# EasyEDA Pro project projeto.eprj

# Schematic Schematic1
Board Name: Board1; Create Date: 2025-10-07; Page Name: P1; Project Name: projeto; Schematic Name: Schematic1; Update Date: 2025-10-07; Company: EasyEDA.com; Page Size: A4; Version: V1.0
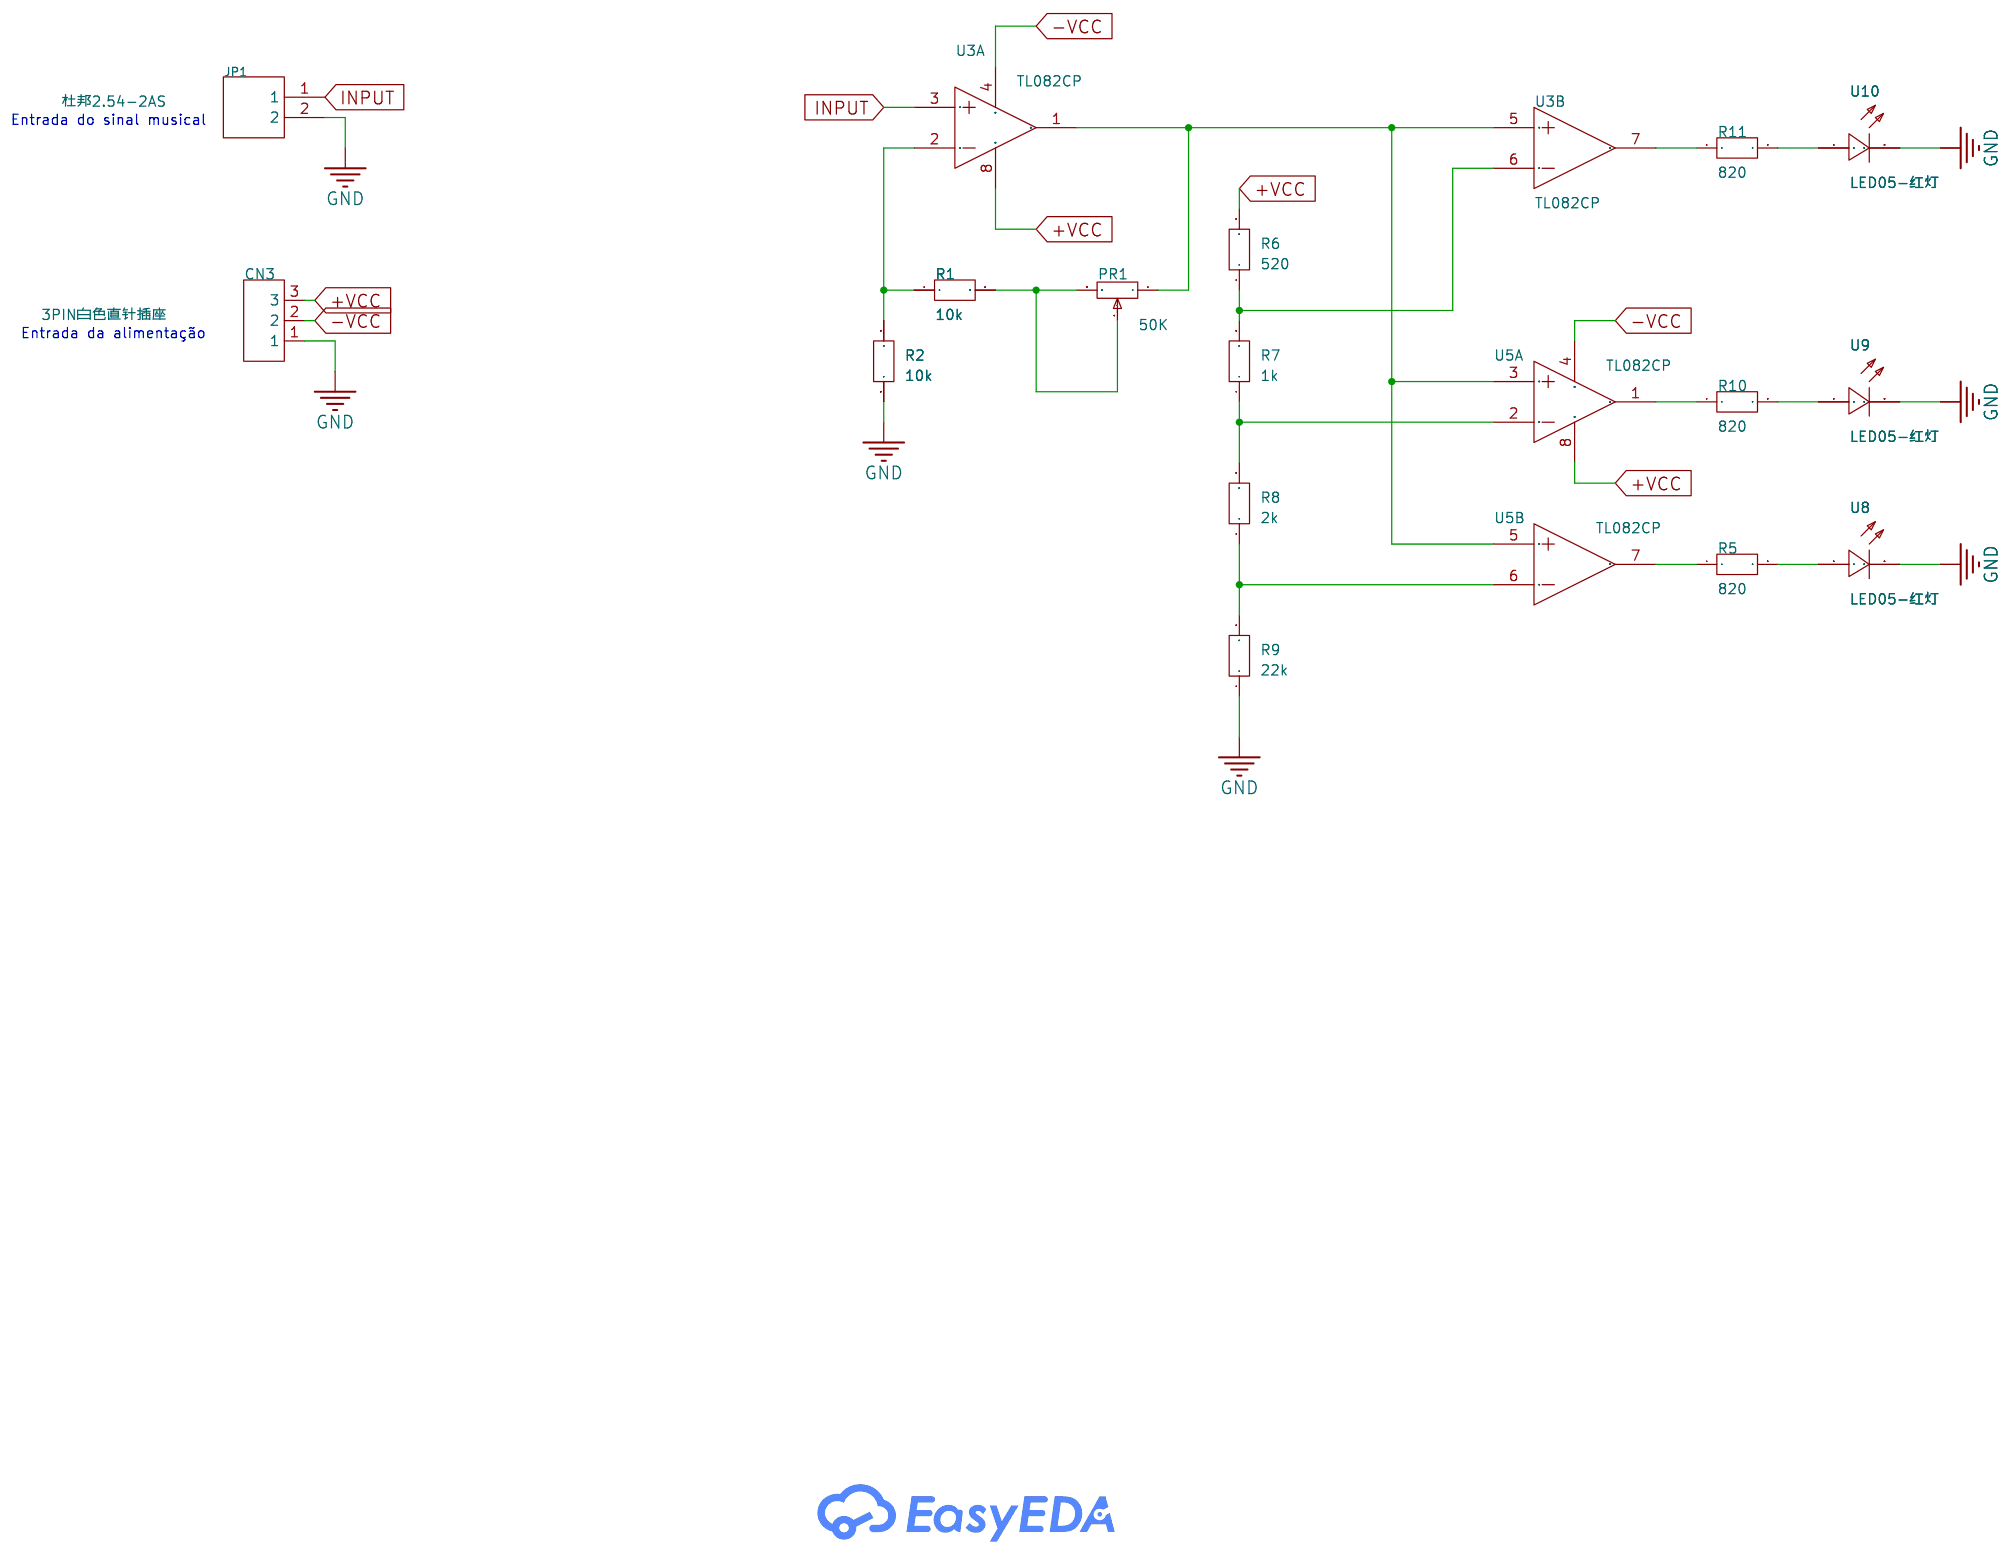
[diagram p0: schematic sheet]

## Parts
CN3  3PIN白色直针插座  [CONN-TH_3P-P2.50_3PIN]
JP1  杜邦2.54-2AS  [CONN-TH_2P-L7.6-W6.0-P2.54-V]
PR1  50K  [CONN-TH_3P-P2.50_3PIN]
R1  10k  [RES-TH_BD4.5-L11.5-P15.50-D0.7]
R2  10k  [RES-TH_BD4.5-L11.5-P15.50-D0.7]
R5  820  [RES-TH_BD4.5-L11.5-P15.50-D0.7]
R6  520  [RES-TH_BD4.5-L11.5-P15.50-D0.7]
R7  1k  [RES-TH_BD4.5-L11.5-P15.50-D0.7]
R8  2k  [RES-TH_BD4.5-L11.5-P15.50-D0.7]
R9  22k  [RES-TH_BD4.5-L11.5-P15.50-D0.7]
R10  820  [RES-TH_BD4.5-L11.5-P15.50-D0.7]
R11  820  [RES-TH_BD4.5-L11.5-P15.50-D0.7]
U3  TL082CP  [PDIP-8_L9.6-W6.4-P2.54-LS7.6-BL]  (sections 1,2)
U5  TL082CP  [PDIP-8_L9.6-W6.4-P2.54-LS7.6-BL]  (sections 1,2)
U8  LED05-红灯  [LED-TH_LED-3MM_RED]
U9  LED05-红灯  [LED-TH_LED-3MM_RED]
U10  LED05-红灯  [LED-TH_LED-3MM_RED]

## Library data of the parts
CN3 = 3PIN白色直针插座: Supplier Part: C9900004958; Supplier Footprint: XH2.54MM; JLCPCB Part Class: Extended Part; Supplier: LCSC
JP1 = 杜邦2.54-2AS: LCSC Part Name: 1x2P 间距:2.54mm 直插; Supplier Part: C50129; Manufacturer: BOOMELE(博穆精密); Supplier Footprint: 插件,P=2.54mm; JLCPCB Part Class: Extended Part; Datasheet: https://item.szlcsc.com/datasheet/%25E6%259D%259C%25E9%2582%25A62.54-2AS/51138.html; Supplier: LCSC; Pins Structure: 1x2P; Pitch: 2.54mm; Mounting Type: Through Hole; Number of Pins: 2P; Number of Rows: 1; Number of PINs Per Row: 2; Current Rating: 3A; Operating Temperature: -25℃~+85℃
PR1 = R_3386P: Supplier Footprint: Through
R1 R2 R5-R11 = MOR02SJ075KA10: Supplier Part: C37390378; Manufacturer: UNI-ROYAL(厚声); Supplier Footprint: 插件,D4.5xL11.5mm; Datasheet: https://item.szlcsc.com/datasheet/MOR02SJ075KA10/39119316.html; Supplier: LCSC; Type: Metal Oxide Film Resistor; Tolerance: ±5%; Power(Watts): 2W; Temperature Coefficient: ±350ppm/℃
U3 U5 = TL082CP: LCSC Part Name: JFET 输入运算放大器; Supplier Part: C75052; Manufacturer: TI(德州仪器); Supplier Footprint: DIP-8; JLCPCB Part Class: Extended Part; Datasheet: https://www.ti.com/cn/lit/gpn/tl082; Supplier: LCSC; Number of Circuits: Dual channel; Gain Bandwidth Product(GBP): 3MHz; Current - Input Bias(Ib): 30pA; Voltage - Input Offset(Vos): 5mV; Slew Rate(SR): 13V/us; Supply Voltage: 5V~15V; Supply Current Per Channel: 1.4mA; Output Current: 2.8mA; Operating Temperature: 0℃~+70℃
U8-U10 = LED05-红灯: Supplier Part: C9900009041; Supplier Footprint: THrough hole; JLCPCB Part Class: Extended Part; Supplier: LCSC

## Nets
+VCC: CN3.3 R6.2 U3.8(VCC+) U5.8(VCC+)
-VCC: CN3.2 U3.4(VCC-) U5.4(VCC-)
GND: CN3.1 JP1.2 R2.1 R9.1 U8.2 U9.2 U10.2
INPUT: JP1.1 U3.3(IN1+)
$1N1297: PR1.2 PR1.3 R1.2
$1N1317: R1.1 R2.2 U3.2(IN1-)
$1N1323: PR1.1 U3.1(OUT1) U3.5(IN2+) U5.3(IN1+) U5.5(IN2+)
$1N1988: R5.1 U5.7(OUT2)
$1N2063: R6.1 R7.2 U3.6(IN2-)
$1N2071: R7.1 R8.2 U5.2(IN1-)
$1N2146: R8.1 R9.2 U5.6(IN2-)
$1N2434: R5.2 U8.1
$1N2538: R10.1 U5.1(OUT1)
$1N2540: R10.2 U9.1
$1N2621: R11.1 U3.7(OUT2)
$1N2623: R11.2 U10.1

## Notes on the sheet
- Entrada do sinal musical
- Entrada da alimentação

# Board PCB1
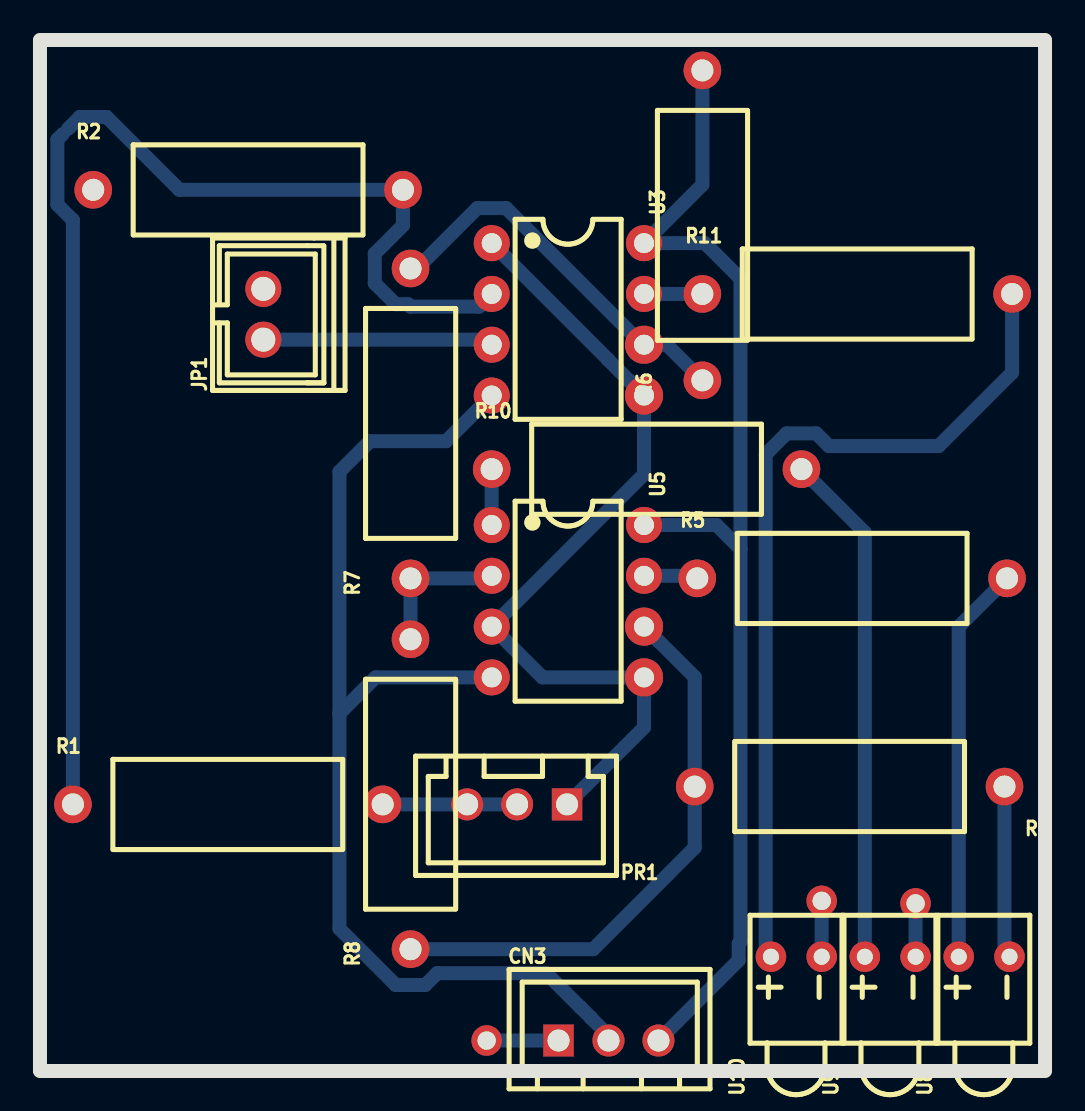
[diagram p1: board, top side]
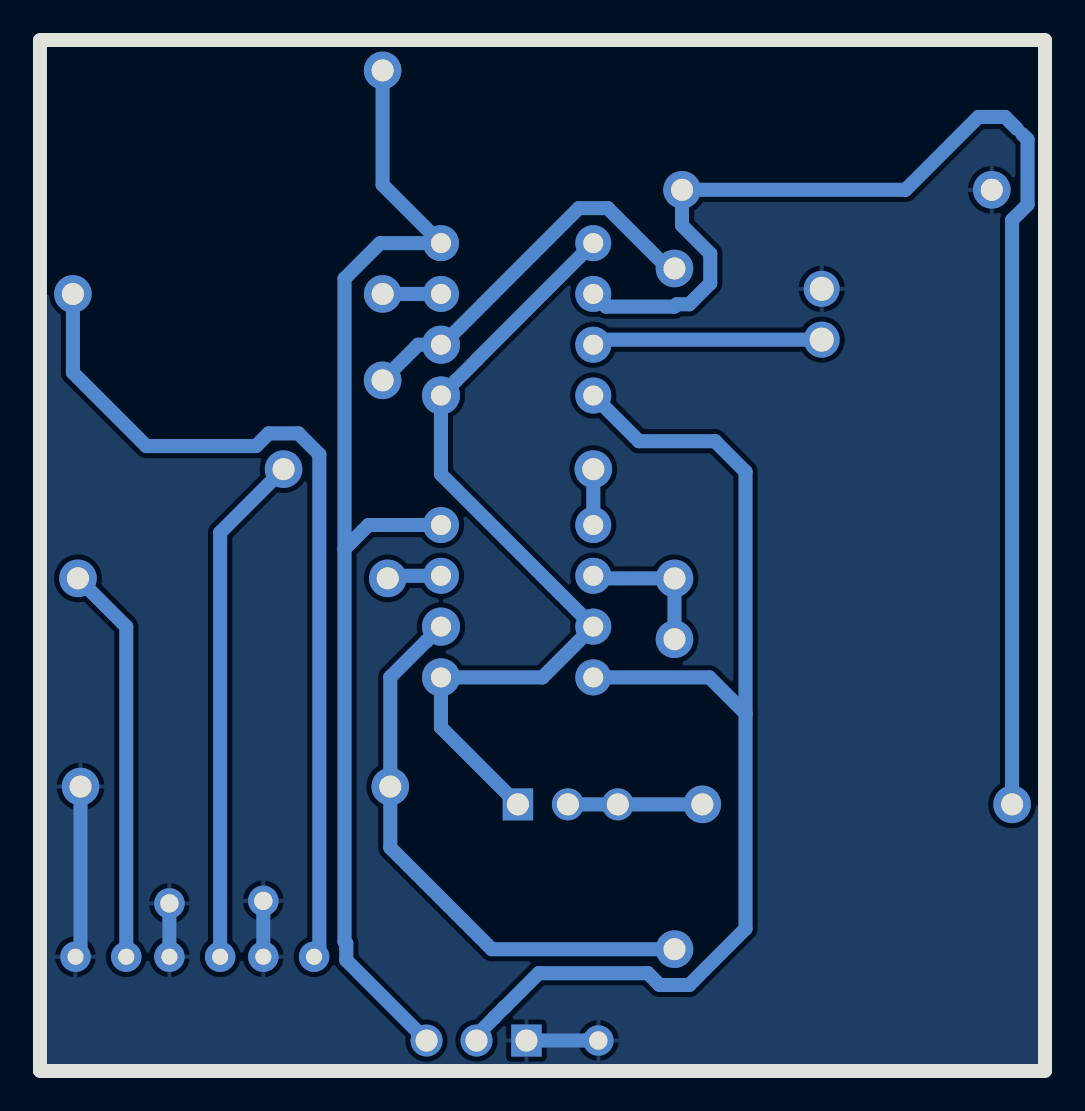
[diagram p2: board, bottom side, seen from below]

Outline 50.29 x 51.56 mm; copper layers: Top Layer, Bottom Layer. Coordinates in mm from the lower left corner of the outline.
Outline path: rectangle 0,51.56 50.29,0
Stack: Top Layer 0.035mm / Dielectric1 1.51mm FR4 er 4.5 / Bottom Layer 0.035mm

## Design rules (mm)
template: Custom Config
spacing copperThickness1oz (default): track to track 0.5, other pairs 0.5 to 0.5
spacing copperThickness2oz: track to track 0.203, other pairs 0.152 to 0.3
track width copperThickness1oz (default): min 0.7, default 0.7, max 2.54
track width copperThickness2oz: min 0.203, default 0.254, max 2.54
differential pair differentialPair (default): width min 0.127, default 0.254, max 2.54; gap min 0.152, default 0.152
via viaSize (default): diameter min 0.5, default 0.61, max 10; hole min 0.3, default 0.305, max 6.3

## Placement (name value [footprint] x y rotation side)
CN3  3PIN白色直针插座  [CONN-TH_3P-P2.50_3PIN]  28.45 1.52 0 top
JP1  杜邦2.54-2AS  [CONN-TH_2P-L7.6-W6.0-P2.54-V]  11.18 37.85 90 top
NOREF  -  [Pad_e59]  39.12 8.51 0 top
NOREF#2  -  [Pad_e348]  43.81 8.38 0 top
NOREF#3  -  [Pad_e40]  22.35 1.52 0 top
PR1  50K  [CONN-TH_3P-P2.50_3PIN]  23.88 13.33 180 top
R1  10k  [RES-TH_BD4.5-L11.5-P15.50-D0.7]  9.4 13.33 0 top
R2  10k  [RES-TH_BD4.5-L11.5-P15.50-D0.7]  10.41 44.07 0 top
R5  820  [RES-TH_BD4.5-L11.5-P15.50-D0.7]  40.64 24.64 0 top
R6  520  [RES-TH_BD4.5-L11.5-P15.50-D0.7]  33.15 42.29 90 top
R7  1k  [RES-TH_BD4.5-L11.5-P15.50-D0.7]  18.54 32.38 90 top
R8  2k  [RES-TH_BD4.5-L11.5-P15.50-D0.7]  18.54 13.84 90 top
R9  22k  [RES-TH_BD4.5-L11.5-P15.50-D0.7]  40.51 14.22 180 top
R10  820  [RES-TH_BD4.5-L11.5-P15.50-D0.7]  30.35 30.1 0 top
R11  820  [RES-TH_BD4.5-L11.5-P15.50-D0.7]  40.89 38.86 0 top
U3  TL082CP  [PDIP-8_L9.6-W6.4-P2.54-LS7.6-BL]  26.42 37.59 270 top
U5  TL082CP  [PDIP-8_L9.6-W6.4-P2.54-LS7.6-BL]  26.42 23.49 270 top
U8  LED05-红灯  [LED-TH_LED-3MM_RED]  47.24 5.71 90 top
U9  LED05-红灯  [LED-TH_LED-3MM_RED]  42.54 5.71 90 top
U10  LED05-红灯  [LED-TH_LED-3MM_RED]  37.85 5.71 90 top

## Footprints (pads in the part's own frame, mm; a bottom-side part is the same pattern mirrored in y, then rotated)
CONN-TH_2P-L7.6-W6.0-P2.54-V
  round 1.8 hole 1.2: 1(-1.27,0) 2(1.27,0)
CONN-TH_3P-P2.50_3PIN
  rect 1.524x1.6 hole 1.1: 1(-2.5,0)
  round 1.6 hole 1.1: 2(0,0) 3(2.5,0)
LED-TH_LED-3MM_RED
  round 1.524 hole 0.8: 1(0,1.27) 2(0,-1.27)
Pad_e40
  round 1.524 hole 0.914: 1(0,0)
Pad_e59
  round 1.524 hole 0.914: 1(0,0)
Pad_e348
  round 1.524 hole 0.914: 1(0,0)
PDIP-8_L9.6-W6.4-P2.54-LS7.6-BL
  round 1.8 hole 1: 1(-3.81,-3.81) 2(-1.27,-3.81) 3(1.27,-3.81) 4(3.81,-3.81) 7(-1.27,3.81) 8(-3.81,3.81)
  round 1.905 hole 1: 5(3.81,3.81) 6(1.27,3.81)
RES-TH_BD4.5-L11.5-P15.50-D0.7
  round 1.879 hole 1.1: 1(-7.75,0) 2(7.75,0)

## Nets
As in the schematic, except:
GND: CN3.1 JP1.2 NOREF.1 NOREF#2.1 NOREF#3.1 R2.1 R9.1 U8.2 U9.2 U10.2

## Routing (per net, layer and track width the routed paths; a pad name or vN(x,y) marks a point on that pad's centre or on a via; arc(x,y) is an arc through that point)
+VCC: length 60.5
  Bottom Layer w0.7: 35.05,26.11 35.05,6.47 34.96,6.38 34.96,5.54 CN3.3 ; 35.05,26.11 35.05,39.62 33.27,41.4 U3.8 33.15,44.32 R6.2 ; 35.05,26.11 33.85,27.3 U5.8
-VCC: length 56.8
  Bottom Layer w0.7: U3.4 20.32,31.5 16.51,31.5 14.99,29.97 14.99,17.88 ; 14.99,17.88 16.79,19.68 U5.4 ; 14.99,17.88 14.99,7.12 17.8,4.3 19.28,4.3 19.87,4.89 25.33,4.89 27.05,3.17 27.06,3.17 27.56,2.68 27.56,2.67 28.45,1.78 CN3.2
GND: length 17.8
  Bottom Layer w0.7: 22.99,1.52 CN3.1 ; 48.26,14.6 48.26,5.97 U8.2 ; NOREF.1 U10.2 ; NOREF#2.1 U9.2 ; 48.51,14.48 48.26,14.73
INPUT: length 11.5
  Bottom Layer w0.7: JP1.1 22.35,36.58 U3.3
$1N1297: length 6.7
  Bottom Layer w0.7: PR1.2 PR1.3 R1.2
$1N1317: length 64.3
  Bottom Layer w0.7: 1.4,47.12 2,47.71 3.33,47.71 6.98,44.07 R2.2 18.16,42.29 16.75,40.88 16.75,39.39 17.8,38.34 18.42,38.34 18.54,38.23 21.97,38.23 U3.2 ; R1.1 1.65,42.55 0.87,43.33 0.87,46.59 1.14,46.86
$1N1323: length 42.1
  Bottom Layer w0.7: U3.1 28.42,35.58 28.42,35.58 29.48,34.52 29.49,34.52 U3.5 30.23,29.84 U5.3 25.15,19.68 U5.5 30.23,17.18 PR1.1
$1N1988: length 2.7
  Bottom Layer w0.7: U5.7 32.76,24.76 R5.1
$1N2063: length 19.4
  Bottom Layer w0.7: R7.2 18.86,40.13 21.88,43.15 23.33,43.15 30.16,36.32 U3.6 31.37,36.32 R6.1
$1N2071: length 7.2
  Bottom Layer w0.7: U5.2 22.48,24.63 R7.1 R8.2
$1N2146: length 28.4
  Bottom Layer w0.7: U5.6 30.96,21.49 30.97,21.49 32.76,19.7 32.76,11.17 27.68,6.09 R8.1
$1N2434: length 19.9
  Bottom Layer w0.7: R5.2 45.97,22.22 U8.1
$1N2538: length 2.8
  Bottom Layer w0.7: R10.1 22.6,27.31 U5.1
$1N2540: length 25.7
  Bottom Layer w0.7: U9.1 41.28,26.93 R10.2
$1N2621: length 2.9
  Bottom Layer w0.7: U3.7 R11.1
$1N2623: length 43.7
  Bottom Layer w0.7: R11.2 48.64,34.93 44.97,31.25 39.48,31.25 38.84,31.89 37.36,31.89 36.31,30.84 36.31,5.98 U10.1

## Copper pours and planes (outline as drawn; the poured copper is in the pictures)
GND on Bottom Layer: -2.29,53.09 52.32,53.09 52.32,-2.16 -2.29,-2.16
